# Altium schematic sheet DigitalInputs.SchDoc
size C; SheetNumber: 6; SheetTotal: 15
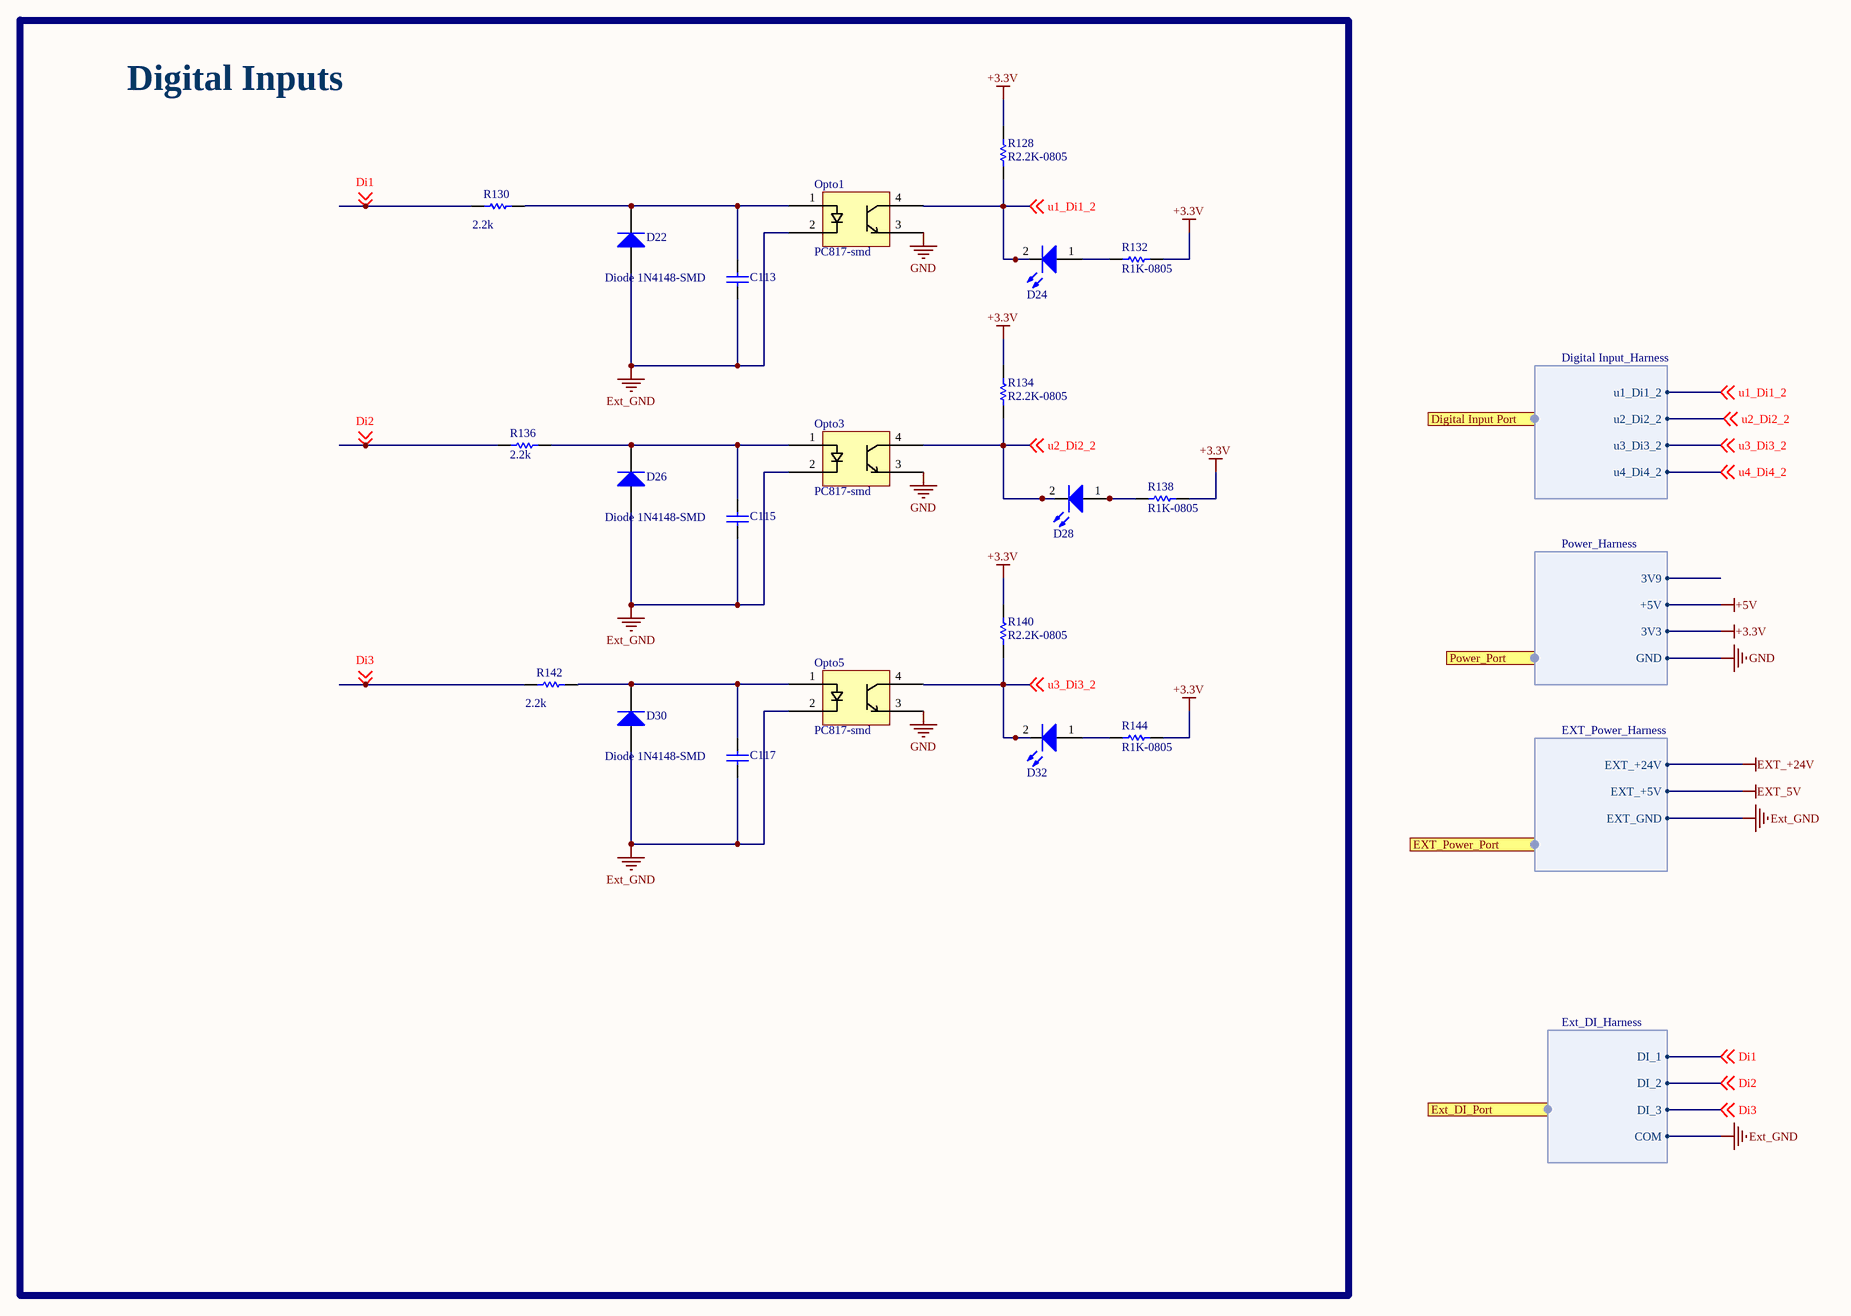
[diagram p0: DigitalInputs.SchDoc]

## Parts
C113  (no value)  [CRF06031]
C115  (no value)  [CRF06031]
C117  (no value)  [CRF06031]
D22  Diode 1N4148-SMD  [d1206]
D24  LED_0805_green  [0805-LED]  (value not drawn)
D26  Diode 1N4148-SMD  [d1206]
D28  LED_0805_green  [0805-LED]  (value not drawn)
D30  Diode 1N4148-SMD  [d1206]
D32  LED_0805_green  [0805-LED]  (value not drawn)
Opto1  PC817-smd  [PC817_SMD1]
Opto3  PC817-smd  [PC817_SMD1]
Opto5  PC817-smd  [PC817_SMD1]
R128  R2.2K-0805  [CRF06031]
R130  2.2k  [r1210]
R132  R1K-0805  [CRF06031]
R134  R2.2K-0805  [CRF06031]
R136  2.2k  [r1210]
R138  R1K-0805  [CRF06031]
R140  R2.2K-0805  [CRF06031]
R142  2.2k  [r1210]
R144  R1K-0805  [CRF06031]

## Ports
Digital Input Port (harness Digital Input_Harness), Ext_DI_Port (harness Ext_DI_Harness), EXT_Power_Port (harness EXT_Power_Harness), Power_Port (harness Power_Harness)

## Harnesses
Digital Input_Harness: u1_Di1_2, u2_Di2_2, u3_Di3_2, u4_Di4_2
EXT_Power_Harness: EXT_+24V, EXT_+5V, EXT_GND
Power_Harness: 3V9, +5V, 3V3, GND
Ext_DI_Harness: DI_1, DI_2, DI_3, COM

## Nets
+3.3V: R128.1 R132.1 R134.1 R138.1 R140.1 R144.1 ; port Power_Port.3V3
+5V: port Power_Port.+5V
EXT_5V: port EXT_Power_Port.EXT_+5V
EXT_+24V: port EXT_Power_Port.EXT_+24V
Ext_GND: C113.1 C115.1 C117.1 D22.1(A) D26.1(A) D30.1(A) Opto1.2 Opto3.2 Opto5.2 ; port EXT_Power_Port.EXT_GND, port Ext_DI_Port.COM
GND: Opto1.3 Opto3.3 Opto5.3 ; port Power_Port.GND
Di1: R130.1 ; off-sheet Di1, port Ext_DI_Port.DI_1
Di2: R136.1 ; off-sheet Di2, port Ext_DI_Port.DI_2
Di3: R142.1 ; off-sheet Di3, port Ext_DI_Port.DI_3
u1_Di1_2: D24.2(K) Opto1.4 R128.2 ; off-sheet u1_Di1_2, port Digital Input Port.u1_Di1_2
u2_Di2_2: D28.2(K) Opto3.4 R134.2 ; off-sheet u2_Di2_2, port Digital Input Port.u2_Di2_2
u3_Di3_2: D32.2(K) Opto5.4 R140.2 ; off-sheet u3_Di3_2, port Digital Input Port.u3_Di3_2
u4_Di4_2: off-sheet u4_Di4_2, port Digital Input Port.u4_Di4_2
NetC113_2: C113.2 D22.2(K) Opto1.1 R130.2
NetC115_2: C115.2 D26.2(K) Opto3.1 R136.2
NetC117_2: C117.2 D30.2(K) Opto5.1 R142.2
NetD24_1: D24.1(A) R132.2
NetD28_1: D28.1(A) R138.2
NetD32_1: D32.1(A) R144.2

## Notes on the sheet
- Digital Inputs

## Library data of the parts
C113 C115 C117 = Cap: Capacitor; Manufacturer_P/N: GCM21BR72A104KA37L; Digi-Key_Part_Number: 490-4789-1-ND; JLC P/N: C85866
D22 D26 D30 = Diode 1N4934: 1 Amp Fast Recovery Rectifier; Manufacturer_P/N: 1N4148WS; Digi-Key_Part_Number: 1N4148WSFSTR-ND; JLC P/N: C2128
D24 D28 D32 = LED_0805: Manufacturer_P/N: NCD0805R1; JLC P/N: C84256
Opto1 Opto3 Opto5 = PC817: Manufacturer_P/N: APC-817D1-SL; Digi-Key_Part_Number: 2007-APC-817D1-SLTR-ND; JLC P/N: C17448553
R128 R130 R134 R136 R140 R142 = Res1: Resistor; Manufacturer_P/N: RC0805FR-072K2L; Digi-Key_Part_Number: 311-2.20KCRTR-ND; JLC P/N: C114561
R132 R138 R144 = Res1: Resistor; Manufacturer_P/N: RC0805FR-071KL; Digi-Key_Part_Number: 311-1.00KCRTR-ND; JLC P/N: C95781